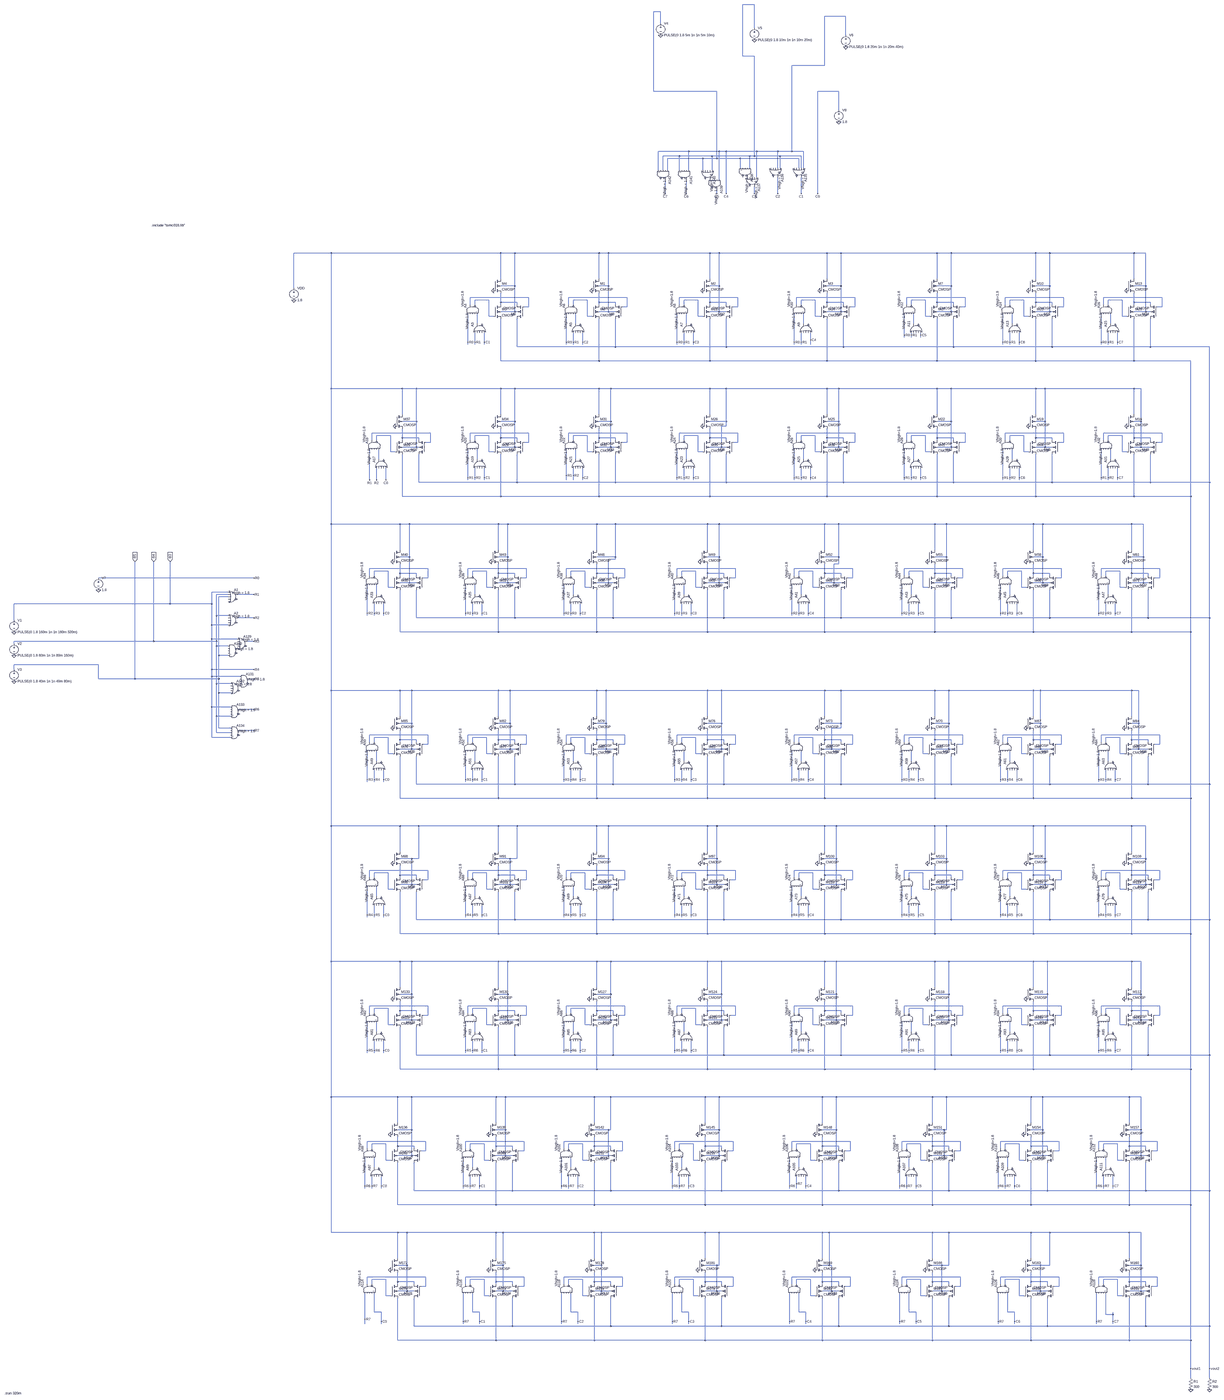
[diagram p0: schematic r_cDAC.asc, whole sheet]
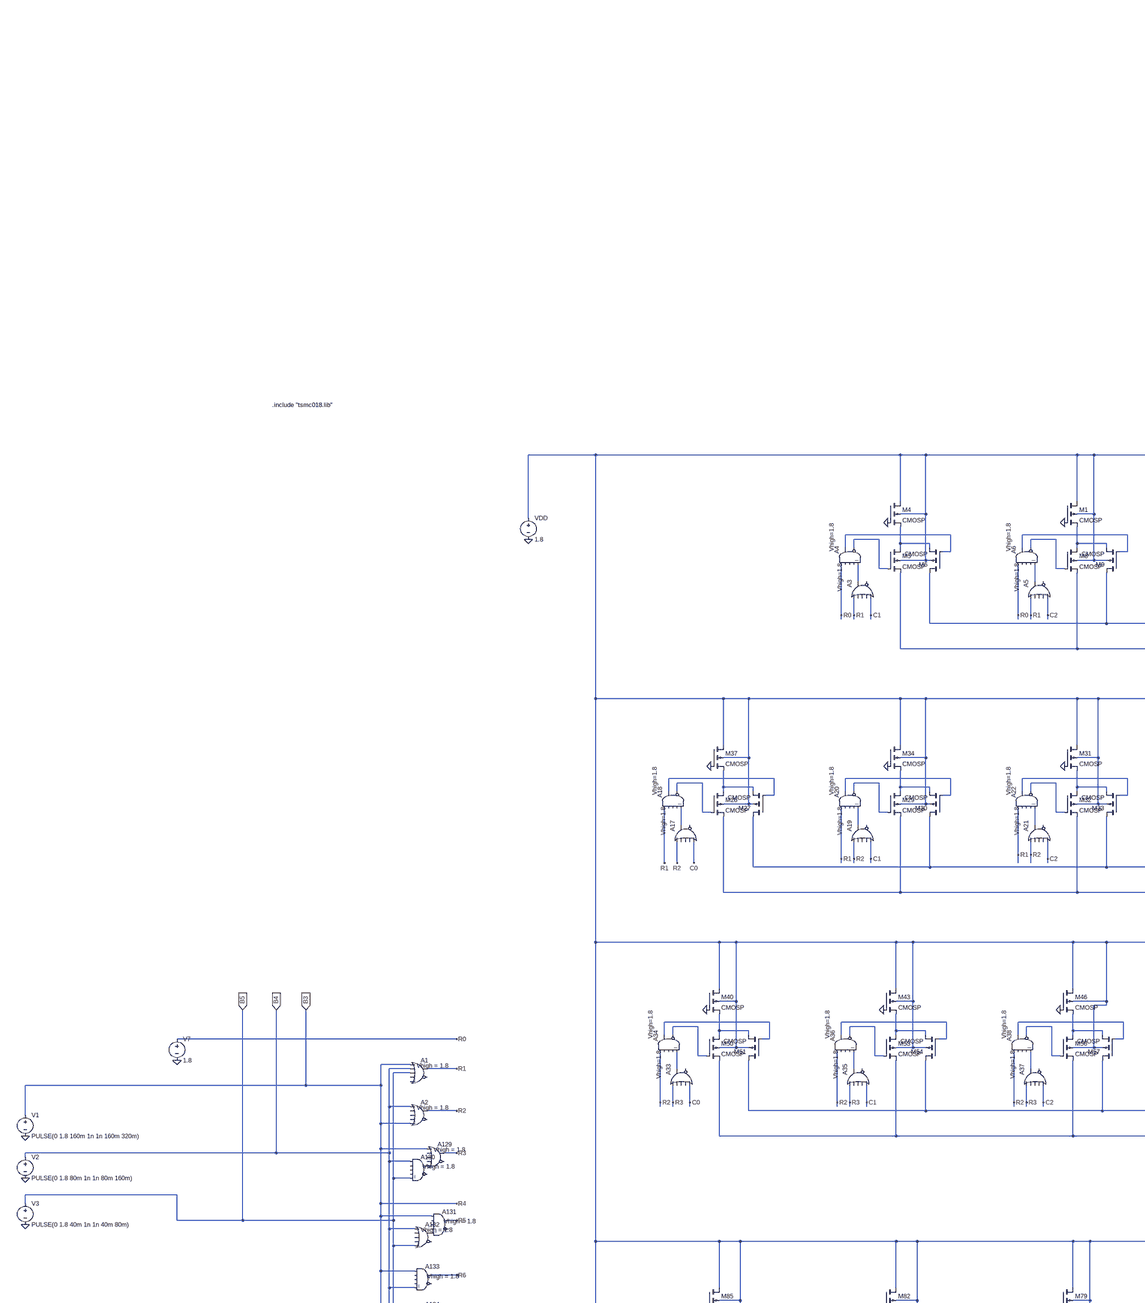
[diagram p1: schematic r_cDAC.asc, part, row 1 of 2, column 1 of 2]
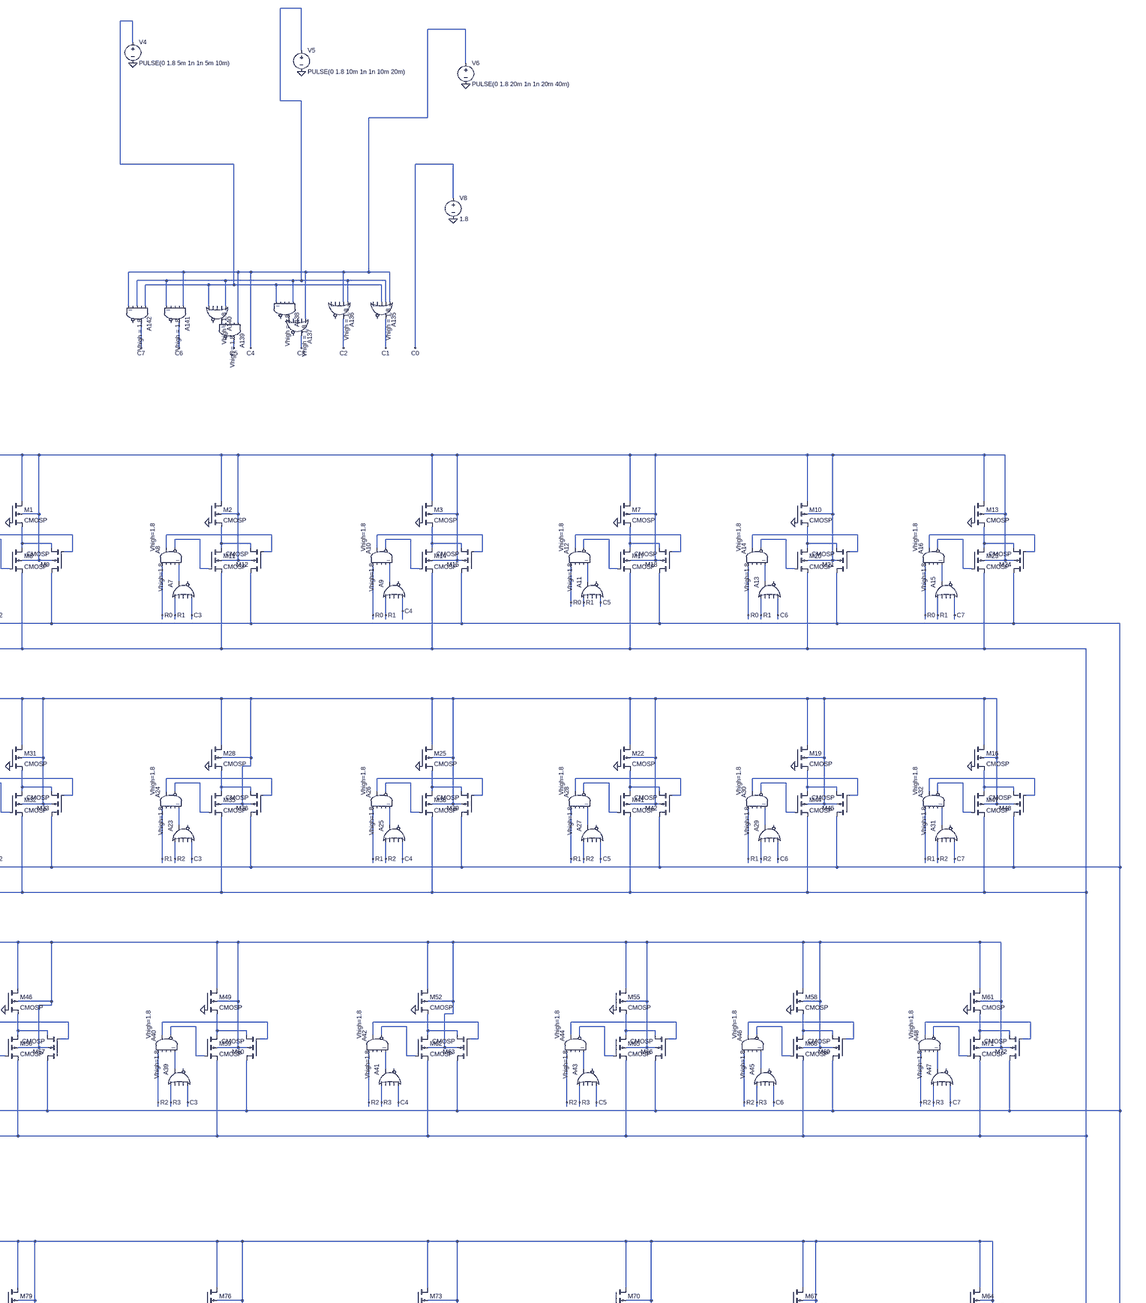
[diagram p2: schematic r_cDAC.asc, part, row 1 of 2, column 2 of 2]
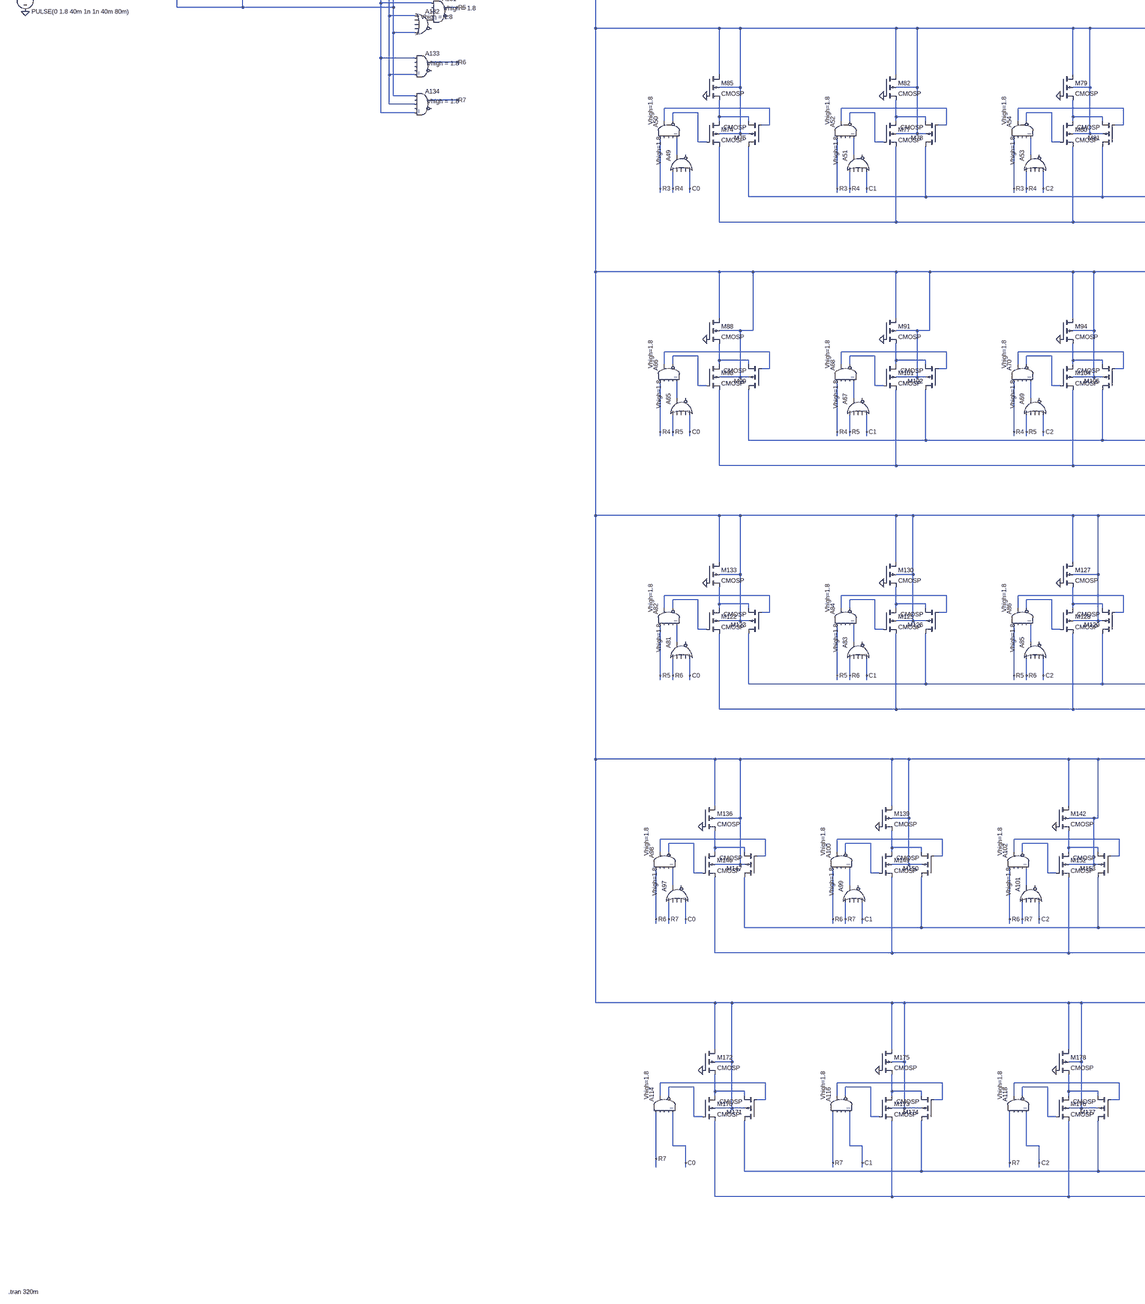
[diagram p3: schematic r_cDAC.asc, part, row 2 of 2, column 1 of 2]
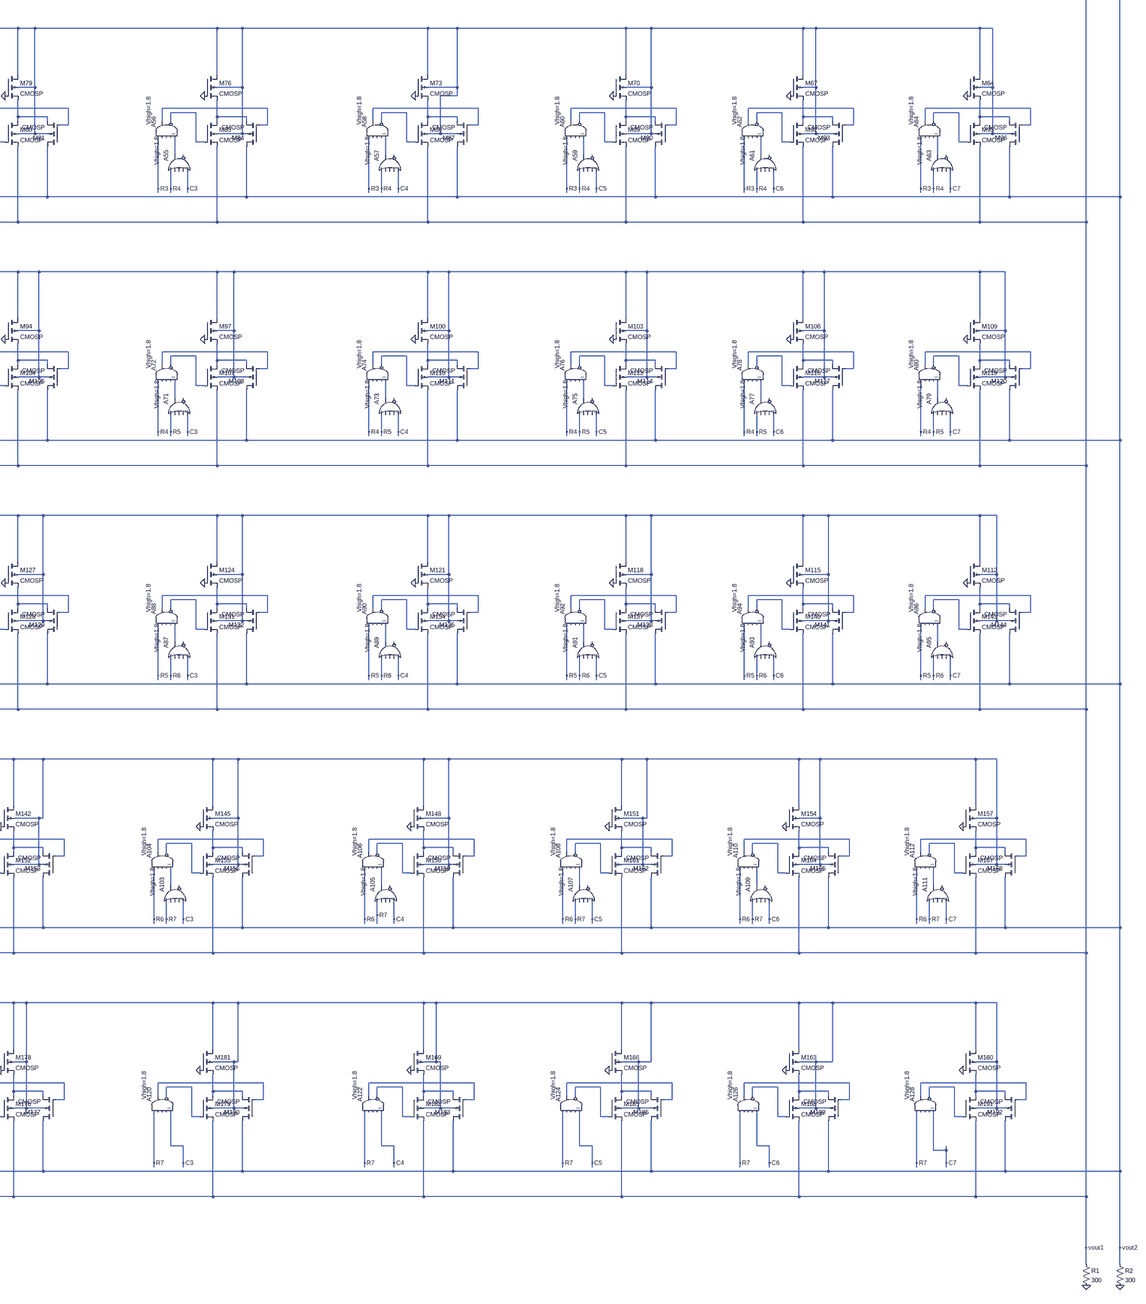
[diagram p4: schematic r_cDAC.asc, part, row 2 of 2, column 2 of 2]
* r_cDAC.asc
A3 R1 0 0 0 C1 0 N025 0 OR Vhigh=1.8
A4 R0 0 0 0 N025 N011 N004 0 AND Vhigh=1.8
M4 N003 0 N018 N003 CMOSP l=1u w=2u
M5 N018 N011 vout1 N003 CMOSP l=1u w=2u
M6 vout2 N004 N018 N003 CMOSP l=1u w=2u
A5 R1 0 0 0 C2 0 N026 0 OR Vhigh=1.8
A6 R0 0 0 0 N026 N012 N005 0 AND Vhigh=1.8
M8 N019 N012 vout1 N003 CMOSP l=1u w=2u
M9 vout2 N005 N019 N003 CMOSP l=1u w=2u
A7 R1 0 0 0 C3 0 N027 0 OR Vhigh=1.8
A8 R0 0 0 0 N027 N013 N006 0 AND Vhigh=1.8
M11 N020 N013 vout1 N003 CMOSP l=1u w=2u
M12 vout2 N006 N020 N003 CMOSP l=1u w=2u
A9 R1 0 0 0 C4 0 N028 0 OR Vhigh=1.8
A10 R0 0 0 0 N028 N014 N007 0 AND Vhigh=1.8
M14 N021 N014 vout1 N003 CMOSP l=1u w=2u
M15 vout2 N007 N021 N003 CMOSP l=1u w=2u
A11 R1 0 0 0 C5 0 N029 0 OR Vhigh=1.8
A12 R0 0 0 0 N029 N015 N008 0 AND Vhigh=1.8
M17 N022 N015 vout1 N003 CMOSP l=1u w=2u
M18 vout2 N008 N022 N003 CMOSP l=1u w=2u
A13 R1 0 0 0 C6 0 N030 0 OR Vhigh=1.8
A14 R0 0 0 0 N030 N016 N009 0 AND Vhigh=1.8
M20 N023 N016 vout1 N003 CMOSP l=1u w=2u
M21 vout2 N009 N023 N003 CMOSP l=1u w=2u
A15 R1 0 0 0 C7 0 N031 0 OR Vhigh=1.8
A16 R0 0 0 0 N031 N017 N010 0 AND Vhigh=1.8
M23 N024 N017 vout1 N003 CMOSP l=1u w=2u
M24 vout2 N010 N024 N003 CMOSP l=1u w=2u
A17 R2 0 0 0 C0 0 N056 0 OR Vhigh=1.8
A18 R1 0 0 0 N056 N040 N032 0 AND Vhigh=1.8
M26 N048 N040 vout1 N003 CMOSP l=1u w=2u
M27 vout2 N032 N048 N003 CMOSP l=1u w=2u
A19 R2 0 0 0 C1 0 N057 0 OR Vhigh=1.8
A20 R1 0 0 0 N057 N041 N033 0 AND Vhigh=1.8
M29 N049 N041 vout1 N003 CMOSP l=1u w=2u
M30 vout2 N033 N049 N003 CMOSP l=1u w=2u
A21 R2 0 0 0 C2 0 N058 0 OR Vhigh=1.8
A22 R1 0 0 0 N058 N042 N034 0 AND Vhigh=1.8
M32 N050 N042 vout1 N003 CMOSP l=1u w=2u
M33 vout2 N034 N050 N003 CMOSP l=1u w=2u
A23 R2 0 0 0 C3 0 N059 0 OR Vhigh=1.8
A24 R1 0 0 0 N059 N043 N035 0 AND Vhigh=1.8
M35 N051 N043 vout1 N003 CMOSP l=1u w=2u
M36 vout2 N035 N051 N003 CMOSP l=1u w=2u
A25 R2 0 0 0 C4 0 N060 0 OR Vhigh=1.8
A26 R1 0 0 0 N060 N044 N036 0 AND Vhigh=1.8
M38 N052 N044 vout1 N003 CMOSP l=1u w=2u
M39 vout2 N036 N052 N003 CMOSP l=1u w=2u
A27 R2 0 0 0 C5 0 N061 0 OR Vhigh=1.8
A28 R1 0 0 0 N061 N045 N037 0 AND Vhigh=1.8
M41 N053 N045 vout1 N003 CMOSP l=1u w=2u
M42 vout2 N037 N053 N003 CMOSP l=1u w=2u
A29 R2 0 0 0 C6 0 N062 0 OR Vhigh=1.8
A30 R1 0 0 0 N062 N046 N038 0 AND Vhigh=1.8
M44 N054 N046 vout1 N003 CMOSP l=1u w=2u
M45 vout2 N038 N054 N003 CMOSP l=1u w=2u
A31 R2 0 0 0 C7 0 N063 0 OR Vhigh=1.8
A32 R1 0 0 0 N063 N047 N039 0 AND Vhigh=1.8
M47 N055 N047 vout1 N003 CMOSP l=1u w=2u
M48 vout2 N039 N055 N003 CMOSP l=1u w=2u
A33 R3 0 0 0 C0 0 N088 0 OR Vhigh=1.8
A34 R2 0 0 0 N088 N072 N064 0 AND Vhigh=1.8
M50 N080 N072 vout1 N003 CMOSP l=1u w=2u
M51 vout2 N064 N080 N003 CMOSP l=1u w=2u
A35 R3 0 0 0 C1 0 N089 0 OR Vhigh=1.8
A36 R2 0 0 0 N089 N073 N065 0 AND Vhigh=1.8
M53 N081 N073 vout1 N003 CMOSP l=1u w=2u
M54 vout2 N065 N081 N003 CMOSP l=1u w=2u
A37 R3 0 0 0 C2 0 N090 0 OR Vhigh=1.8
A38 R2 0 0 0 N090 N074 N066 0 AND Vhigh=1.8
M56 N082 N074 vout1 N003 CMOSP l=1u w=2u
M57 vout2 N066 N082 N003 CMOSP l=1u w=2u
A39 R3 0 0 0 C3 0 N091 0 OR Vhigh=1.8
A40 R2 0 0 0 N091 N075 N067 0 AND Vhigh=1.8
M59 N083 N075 vout1 N003 CMOSP l=1u w=2u
M60 vout2 N067 N083 N003 CMOSP l=1u w=2u
A41 R3 0 0 0 C4 0 N092 0 OR Vhigh=1.8
A42 R2 0 0 0 N092 N076 N068 0 AND Vhigh=1.8
M62 N084 N076 vout1 N003 CMOSP l=1u w=2u
M63 vout2 N068 N084 N003 CMOSP l=1u w=2u
A43 R3 0 0 0 C5 0 N093 0 OR Vhigh=1.8
A44 R2 0 0 0 N093 N077 N069 0 AND Vhigh=1.8
M65 N085 N077 vout1 N003 CMOSP l=1u w=2u
M66 vout2 N069 N085 N003 CMOSP l=1u w=2u
A45 R3 0 0 0 C6 0 N094 0 OR Vhigh=1.8
A46 R2 0 0 0 N094 N078 N070 0 AND Vhigh=1.8
M68 N086 N078 vout1 N003 CMOSP l=1u w=2u
M69 vout2 N070 N086 N003 CMOSP l=1u w=2u
A47 R3 0 0 0 C7 0 N095 0 OR Vhigh=1.8
A48 R2 0 0 0 N095 N079 N071 0 AND Vhigh=1.8
M71 N087 N079 vout1 N003 CMOSP l=1u w=2u
M72 vout2 N071 N087 N003 CMOSP l=1u w=2u
A49 R4 0 0 0 C0 0 N120 0 OR Vhigh=1.8
A50 R3 0 0 0 N120 N104 N096 0 AND Vhigh=1.8
M74 N112 N104 vout1 N003 CMOSP l=1u w=2u
M75 vout2 N096 N112 N003 CMOSP l=1u w=2u
A51 R4 0 0 0 C1 0 N121 0 OR Vhigh=1.8
A52 R3 0 0 0 N121 N105 N097 0 AND Vhigh=1.8
M77 N113 N105 vout1 N003 CMOSP l=1u w=2u
M78 vout2 N097 N113 N003 CMOSP l=1u w=2u
A53 R4 0 0 0 C2 0 N122 0 OR Vhigh=1.8
A54 R3 0 0 0 N122 N106 N098 0 AND Vhigh=1.8
M80 N114 N106 vout1 N003 CMOSP l=1u w=2u
M81 vout2 N098 N114 N003 CMOSP l=1u w=2u
A55 R4 0 0 0 C3 0 N123 0 OR Vhigh=1.8
A56 R3 0 0 0 N123 N107 N099 0 AND Vhigh=1.8
M83 N115 N107 vout1 N003 CMOSP l=1u w=2u
M84 vout2 N099 N115 N003 CMOSP l=1u w=2u
A57 R4 0 0 0 C4 0 N124 0 OR Vhigh=1.8
A58 R3 0 0 0 N124 N108 N100 0 AND Vhigh=1.8
M86 N116 N108 vout1 N003 CMOSP l=1u w=2u
M87 vout2 N100 N116 N003 CMOSP l=1u w=2u
A59 R4 0 0 0 C5 0 N125 0 OR Vhigh=1.8
A60 R3 0 0 0 N125 N109 N101 0 AND Vhigh=1.8
M89 N117 N109 vout1 N003 CMOSP l=1u w=2u
M90 vout2 N101 N117 N003 CMOSP l=1u w=2u
A61 R4 0 0 0 C6 0 N126 0 OR Vhigh=1.8
A62 R3 0 0 0 N126 N110 N102 0 AND Vhigh=1.8
M92 N118 N110 vout1 N003 CMOSP l=1u w=2u
M93 vout2 N102 N118 N003 CMOSP l=1u w=2u
A63 R4 0 0 0 C7 0 N127 0 OR Vhigh=1.8
A64 R3 0 0 0 N127 N111 N103 0 AND Vhigh=1.8
M95 N119 N111 vout1 N003 CMOSP l=1u w=2u
M96 vout2 N103 N119 N003 CMOSP l=1u w=2u
A65 R5 0 0 0 C0 0 N152 0 OR Vhigh=1.8
A66 R4 0 0 0 N152 N136 N128 0 AND Vhigh=1.8
M98 N144 N136 vout1 N003 CMOSP l=1u w=2u
M99 vout2 N128 N144 N003 CMOSP l=1u w=2u
A67 R5 0 0 0 C1 0 N153 0 OR Vhigh=1.8
A68 R4 0 0 0 N153 N137 N129 0 AND Vhigh=1.8
M101 N145 N137 vout1 N003 CMOSP l=1u w=2u
M102 vout2 N129 N145 N003 CMOSP l=1u w=2u
A69 R5 0 0 0 C2 0 N154 0 OR Vhigh=1.8
A70 R4 0 0 0 N154 N138 N130 0 AND Vhigh=1.8
M104 N146 N138 vout1 N003 CMOSP l=1u w=2u
M105 vout2 N130 N146 N003 CMOSP l=1u w=2u
A71 R5 0 0 0 C3 0 N155 0 OR Vhigh=1.8
A72 R4 0 0 0 N155 N139 N131 0 AND Vhigh=1.8
M107 N147 N139 vout1 N003 CMOSP l=1u w=2u
M108 vout2 N131 N147 N003 CMOSP l=1u w=2u
A73 R5 0 0 0 C4 0 N156 0 OR Vhigh=1.8
A74 R4 0 0 0 N156 N140 N132 0 AND Vhigh=1.8
M110 N148 N140 vout1 N003 CMOSP l=1u w=2u
M111 vout2 N132 N148 N003 CMOSP l=1u w=2u
A75 R5 0 0 0 C5 0 N157 0 OR Vhigh=1.8
A76 R4 0 0 0 N157 N141 N133 0 AND Vhigh=1.8
M113 N149 N141 vout1 N003 CMOSP l=1u w=2u
M114 vout2 N133 N149 N003 CMOSP l=1u w=2u
A77 R5 0 0 0 C6 0 N158 0 OR Vhigh=1.8
A78 R4 0 0 0 N158 N142 N134 0 AND Vhigh=1.8
M116 N150 N142 vout1 N003 CMOSP l=1u w=2u
M117 vout2 N134 N150 N003 CMOSP l=1u w=2u
A79 R5 0 0 0 C7 0 N159 0 OR Vhigh=1.8
A80 R4 0 0 0 N159 N143 N135 0 AND Vhigh=1.8
M119 N151 N143 vout1 N003 CMOSP l=1u w=2u
M120 vout2 N135 N151 N003 CMOSP l=1u w=2u
A81 R6 0 0 0 C0 0 N184 0 OR Vhigh=1.8
A82 R5 0 0 0 N184 N168 N160 0 AND Vhigh=1.8
M122 N176 N168 vout1 N003 CMOSP l=1u w=2u
M123 vout2 N160 N176 N003 CMOSP l=1u w=2u
A83 R6 0 0 0 C1 0 N185 0 OR Vhigh=1.8
A84 R5 0 0 0 N185 N169 N161 0 AND Vhigh=1.8
M125 N177 N169 vout1 N003 CMOSP l=1u w=2u
M126 vout2 N161 N177 N003 CMOSP l=1u w=2u
A85 R6 0 0 0 C2 0 N186 0 OR Vhigh=1.8
A86 R5 0 0 0 N186 N170 N162 0 AND Vhigh=1.8
M128 N178 N170 vout1 N003 CMOSP l=1u w=2u
M129 vout2 N162 N178 N003 CMOSP l=1u w=2u
A87 R6 0 0 0 C3 0 N187 0 OR Vhigh=1.8
A88 R5 0 0 0 N187 N171 N163 0 AND Vhigh=1.8
M131 N179 N171 vout1 N003 CMOSP l=1u w=2u
M132 vout2 N163 N179 N003 CMOSP l=1u w=2u
A89 R6 0 0 0 C4 0 N188 0 OR Vhigh=1.8
A90 R5 0 0 0 N188 N172 N164 0 AND Vhigh=1.8
M134 N180 N172 vout1 N003 CMOSP l=1u w=2u
M135 vout2 N164 N180 N003 CMOSP l=1u w=2u
A91 R6 0 0 0 C5 0 N189 0 OR Vhigh=1.8
A92 R5 0 0 0 N189 N173 N165 0 AND Vhigh=1.8
M137 N181 N173 vout1 N003 CMOSP l=1u w=2u
M138 vout2 N165 N181 N003 CMOSP l=1u w=2u
A93 R6 0 0 0 C6 0 N190 0 OR Vhigh=1.8
A94 R5 0 0 0 N190 N174 N166 0 AND Vhigh=1.8
M140 N182 N174 vout1 N003 CMOSP l=1u w=2u
M141 vout2 N166 N182 N003 CMOSP l=1u w=2u
A95 R6 0 0 0 C7 0 N191 0 OR Vhigh=1.8
A96 R5 0 0 0 N191 N175 N167 0 AND Vhigh=1.8
M143 N183 N175 vout1 N003 CMOSP l=1u w=2u
M144 vout2 N167 N183 N003 CMOSP l=1u w=2u
A97 R7 0 0 0 C0 0 N216 0 OR Vhigh=1.8
A98 R6 0 0 0 N216 N200 N192 0 AND Vhigh=1.8
M146 N208 N200 vout1 N003 CMOSP l=1u w=2u
M147 vout2 N192 N208 N003 CMOSP l=1u w=2u
A99 R7 0 0 0 C1 0 N217 0 OR Vhigh=1.8
A100 R6 0 0 0 N217 N201 N193 0 AND Vhigh=1.8
M149 N209 N201 vout1 N003 CMOSP l=1u w=2u
M150 vout2 N193 N209 N003 CMOSP l=1u w=2u
A101 R7 0 0 0 C2 0 N218 0 OR Vhigh=1.8
A102 R6 0 0 0 N218 N202 N194 0 AND Vhigh=1.8
M152 N210 N202 vout1 N003 CMOSP l=1u w=2u
M153 vout2 N194 N210 N003 CMOSP l=1u w=2u
A103 R7 0 0 0 C3 0 N219 0 OR Vhigh=1.8
A104 R6 0 0 0 N219 N203 N195 0 AND Vhigh=1.8
M155 N211 N203 vout1 N003 CMOSP l=1u w=2u
M156 vout2 N195 N211 N003 CMOSP l=1u w=2u
A105 R7 0 0 0 C4 0 N220 0 OR Vhigh=1.8
A106 R6 0 0 0 N220 N204 N196 0 AND Vhigh=1.8
M158 N212 N204 vout1 N003 CMOSP l=1u w=2u
M159 vout2 N196 N212 N003 CMOSP l=1u w=2u
A107 R7 0 0 0 C5 0 N221 0 OR Vhigh=1.8
A108 R6 0 0 0 N221 N205 N197 0 AND Vhigh=1.8
M161 N213 N205 vout1 N003 CMOSP l=1u w=2u
M162 vout2 N197 N213 N003 CMOSP l=1u w=2u
A109 R7 0 0 0 C6 0 N222 0 OR Vhigh=1.8
A110 R6 0 0 0 N222 N206 N198 0 AND Vhigh=1.8
M164 N214 N206 vout1 N003 CMOSP l=1u w=2u
M165 vout2 N198 N214 N003 CMOSP l=1u w=2u
A111 R7 0 0 0 C7 0 N223 0 OR Vhigh=1.8
A112 R6 0 0 0 N223 N207 N199 0 AND Vhigh=1.8
M167 N215 N207 vout1 N003 CMOSP l=1u w=2u
M168 vout2 N199 N215 N003 CMOSP l=1u w=2u
A114 R7 0 0 0 C0 N232 N224 0 AND Vhigh=1.8
M170 N240 N232 vout1 N003 CMOSP l=1u w=2u
M171 vout2 N224 N240 N003 CMOSP l=1u w=2u
A116 R7 0 0 0 C1 N233 N225 0 AND Vhigh=1.8
M173 N241 N233 vout1 N003 CMOSP l=1u w=2u
M174 vout2 N225 N241 N003 CMOSP l=1u w=2u
A118 R7 0 0 0 C2 N234 N226 0 AND Vhigh=1.8
M176 N242 N234 vout1 N003 CMOSP l=1u w=2u
M177 vout2 N226 N242 N003 CMOSP l=1u w=2u
A120 R7 0 0 0 C3 N235 N227 0 AND Vhigh=1.8
M179 N243 N235 vout1 N003 CMOSP l=1u w=2u
M180 vout2 N227 N243 N003 CMOSP l=1u w=2u
A122 R7 0 0 0 C4 N236 N228 0 AND Vhigh=1.8
M182 N244 N236 vout1 N003 CMOSP l=1u w=2u
M183 vout2 N228 N244 N003 CMOSP l=1u w=2u
A124 R7 0 0 0 C5 N237 N229 0 AND Vhigh=1.8
M185 N245 N237 vout1 N003 CMOSP l=1u w=2u
M186 vout2 N229 N245 N003 CMOSP l=1u w=2u
A126 R7 0 0 0 C6 N238 N230 0 AND Vhigh=1.8
M188 N246 N238 vout1 N003 CMOSP l=1u w=2u
M189 vout2 N230 N246 N003 CMOSP l=1u w=2u
A128 R7 0 0 0 C7 N239 N231 0 AND Vhigh=1.8
M191 N247 N239 vout1 N003 CMOSP l=1u w=2u
M192 vout2 N231 N247 N003 CMOSP l=1u w=2u
R1 vout1 0 300
R2 vout2 0 300
A1 R4 B4 B5 0 0 0 R1 0 OR Vhigh = 1.8
A2 B4 0 0 0 R4 0 R2 0 OR Vhigh = 1.8
A129 R4 0 0 0 P001 0 R3 0 OR Vhigh = 1.8
A130 B4 0 0 0 B5 0 P001 0 AND Vhigh = 1.8
A131 R4 0 0 0 P002 0 R5 0 AND Vhigh = 1.8
A132 B4 0 0 0 B5 0 P002 0 OR Vhigh = 1.8
A133 R4 0 0 0 B4 0 R6 0 AND Vhigh = 1.8
A134 B5 0 B4 0 R4 0 R7 0 AND Vhigh = 1.8
A135 C4 N001 N002 0 0 0 C1 0 OR Vhigh = 1.8
A136 N001 C4 0 0 0 0 C2 0 OR Vhigh = 1.8
A137 C4 0 0 0 P003 0 C3 0 OR Vhigh = 1.8
A138 N001 0 0 0 N002 0 P003 0 AND Vhigh = 1.8
A139 C4 0 0 0 P004 0 C5 0 AND Vhigh = 1.8
A140 N001 0 0 0 N002 0 P004 0 OR Vhigh = 1.8
A141 C4 0 0 0 N001 0 C6 0 AND Vhigh = 1.8
A142 N002 0 N001 0 C4 0 C7 0 AND Vhigh = 1.8
V1 R4 0 PULSE(0 1.8 160m 1n 1n 160m 320m)
V2 B4 0 PULSE(0 1.8 80m 1n 1n 80m 160m)
V3 B5 0 PULSE(0 1.8 40m 1n 1n 40m 80m)
V4 N002 0 PULSE(0 1.8 5m 1n 1n 5m 10m)
V5 N001 0 PULSE(0 1.8 10m 1n 1n 10m 20m)
V6 C4 0 PULSE(0 1.8 20m 1n 1n 20m 40m)
V7 R0 0 1.8
V8 C0 0 1.8
VDD N003 0 1.8
M1 N003 0 N019 N003 CMOSP l=1u w=2u
M2 N003 0 N020 N003 CMOSP l=1u w=2u
M3 N003 0 N021 N003 CMOSP l=1u w=2u
M7 N003 0 N022 N003 CMOSP l=1u w=2u
M10 N003 0 N023 N003 CMOSP l=1u w=2u
M13 N003 0 N024 N003 CMOSP l=1u w=2u
M16 N003 0 N055 N003 CMOSP l=1u w=2u
M19 N003 0 N054 N003 CMOSP l=1u w=2u
M22 N003 0 N053 N003 CMOSP l=1u w=2u
M25 N003 0 N052 N003 CMOSP l=1u w=2u
M28 N003 0 N051 N003 CMOSP l=1u w=2u
M31 N003 0 N050 N003 CMOSP l=1u w=2u
M34 N003 0 N049 N003 CMOSP l=1u w=2u
M37 N003 0 N048 N003 CMOSP l=1u w=2u
M40 N003 0 N080 N003 CMOSP l=1u w=2u
M43 N003 0 N081 N003 CMOSP l=1u w=2u
M46 N003 0 N082 N003 CMOSP l=1u w=2u
M49 N003 0 N083 N003 CMOSP l=1u w=2u
M52 N003 0 N084 N003 CMOSP l=1u w=2u
M55 N003 0 N085 N003 CMOSP l=1u w=2u
M58 N003 0 N086 N003 CMOSP l=1u w=2u
M61 N003 0 N087 N003 CMOSP l=1u w=2u
M64 N003 0 N119 N003 CMOSP l=1u w=2u
M67 N003 0 N118 N003 CMOSP l=1u w=2u
M70 N003 0 N117 N003 CMOSP l=1u w=2u
M73 N003 0 N116 N003 CMOSP l=1u w=2u
M76 N003 0 N115 N003 CMOSP l=1u w=2u
M79 N003 0 N114 N003 CMOSP l=1u w=2u
M82 N003 0 N113 N003 CMOSP l=1u w=2u
M85 N003 0 N112 N003 CMOSP l=1u w=2u
M88 N003 0 N144 N003 CMOSP l=1u w=2u
M91 N003 0 N145 N003 CMOSP l=1u w=2u
M94 N003 0 N146 N003 CMOSP l=1u w=2u
M97 N003 0 N147 N003 CMOSP l=1u w=2u
M100 N003 0 N148 N003 CMOSP l=1u w=2u
M103 N003 0 N149 N003 CMOSP l=1u w=2u
M106 N003 0 N150 N003 CMOSP l=1u w=2u
M109 N003 0 N151 N003 CMOSP l=1u w=2u
M112 N003 0 N183 N003 CMOSP l=1u w=2u
M115 N003 0 N182 N003 CMOSP l=1u w=2u
M118 N003 0 N181 N003 CMOSP l=1u w=2u
M121 N003 0 N180 N003 CMOSP l=1u w=2u
M124 N003 0 N179 N003 CMOSP l=1u w=2u
M127 N003 0 N178 N003 CMOSP l=1u w=2u
M130 N003 0 N177 N003 CMOSP l=1u w=2u
M133 N003 0 N176 N003 CMOSP l=1u w=2u
M136 N003 0 N208 N003 CMOSP l=1u w=2u
M139 N003 0 N209 N003 CMOSP l=1u w=2u
M142 N003 0 N210 N003 CMOSP l=1u w=2u
M145 N003 0 N211 N003 CMOSP l=1u w=2u
M148 N003 0 N212 N003 CMOSP l=1u w=2u
M151 N003 0 N213 N003 CMOSP l=1u w=2u
M154 N003 0 N214 N003 CMOSP l=1u w=2u
M157 N003 0 N215 N003 CMOSP l=1u w=2u
M160 N003 0 N247 N003 CMOSP l=1u w=2u
M163 N003 0 N246 N003 CMOSP l=1u w=2u
M166 N003 0 N245 N003 CMOSP l=1u w=2u
M169 N003 0 N244 N003 CMOSP l=1u w=2u
M172 N003 0 N240 N003 CMOSP l=1u w=2u
M175 N003 0 N241 N003 CMOSP l=1u w=2u
M178 N003 0 N242 N003 CMOSP l=1u w=2u
M181 N003 0 N243 N003 CMOSP l=1u w=2u
.model NMOS NMOS
.model PMOS PMOS
.lib standard.mos
.include "tsmc018.lib"
.tran 320m
.backanno
.end